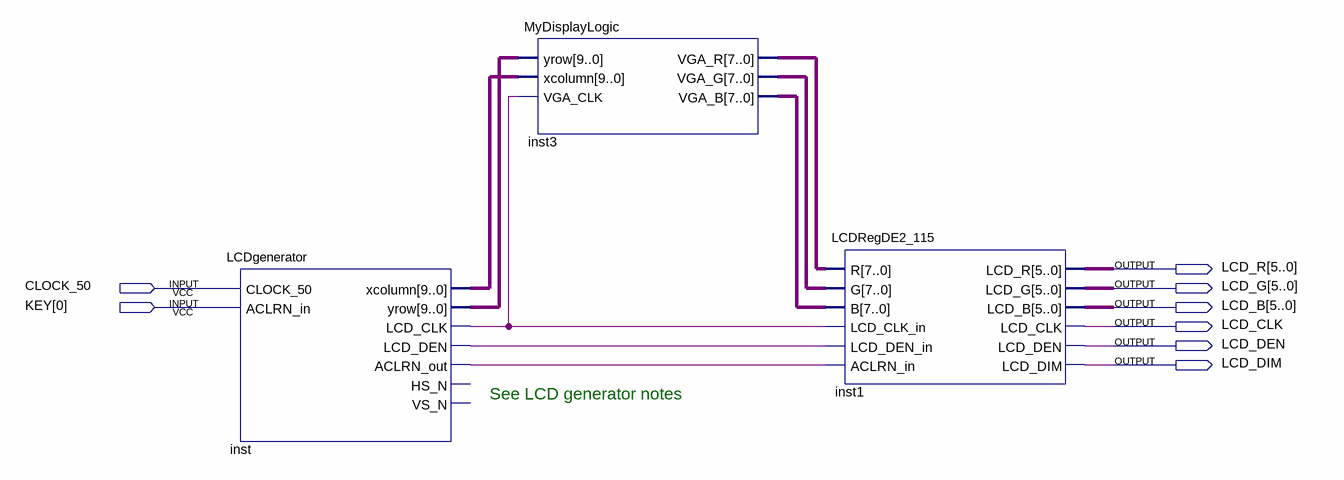
[diagram p0: schematic sheet]
// Quartus schematic Demo_LCD.bdf as structural Verilog: 3 symbols, 8 pins
module Demo_LCD (
  input  CLOCK_50,
  input  [0:0] KEY,
  output [5:0] LCD_R,
  output [5:0] LCD_G,
  output [5:0] LCD_B,
  output LCD_CLK,
  output LCD_DEN,
  output LCD_DIM
);

  wire inst_aclrn_out, inst_lcd_clk, inst_lcd_den;
  wire [7:0] inst3_vga_b, inst3_vga_g, inst3_vga_r;
  wire [9:0] inst_xcolumn, inst_yrow;

  LCDgenerator inst (
    .CLOCK_50(CLOCK_50), .ACLRN_in(KEY[0]), .xcolumn(inst_xcolumn), .yrow(inst_yrow), .LCD_CLK(inst_lcd_clk),
    .LCD_DEN(inst_lcd_den), .ACLRN_out(inst_aclrn_out));  // open: HS_N, VS_N
  MyDisplayLogic inst3 (
    .yrow(inst_yrow), .xcolumn(inst_xcolumn), .VGA_CLK(inst_lcd_clk), .VGA_R(inst3_vga_r),
    .VGA_G(inst3_vga_g), .VGA_B(inst3_vga_b));
  LCDRegDE2_115 inst1 (
    .R(inst3_vga_r), .G(inst3_vga_g), .B(inst3_vga_b), .LCD_CLK_in(inst_lcd_clk), .LCD_DEN_in(inst_lcd_den),
    .ACLRN_in(inst_aclrn_out), .LCD_R(LCD_R), .LCD_G(LCD_G), .LCD_B(LCD_B), .LCD_CLK(LCD_CLK),
    .LCD_DEN(LCD_DEN), .LCD_DIM(LCD_DIM));

  // Notes on the sheet:
  //   See LCD generator notes
endmodule
